# EAGLE design BOTS_Latch (EAGLE 9.2.2)
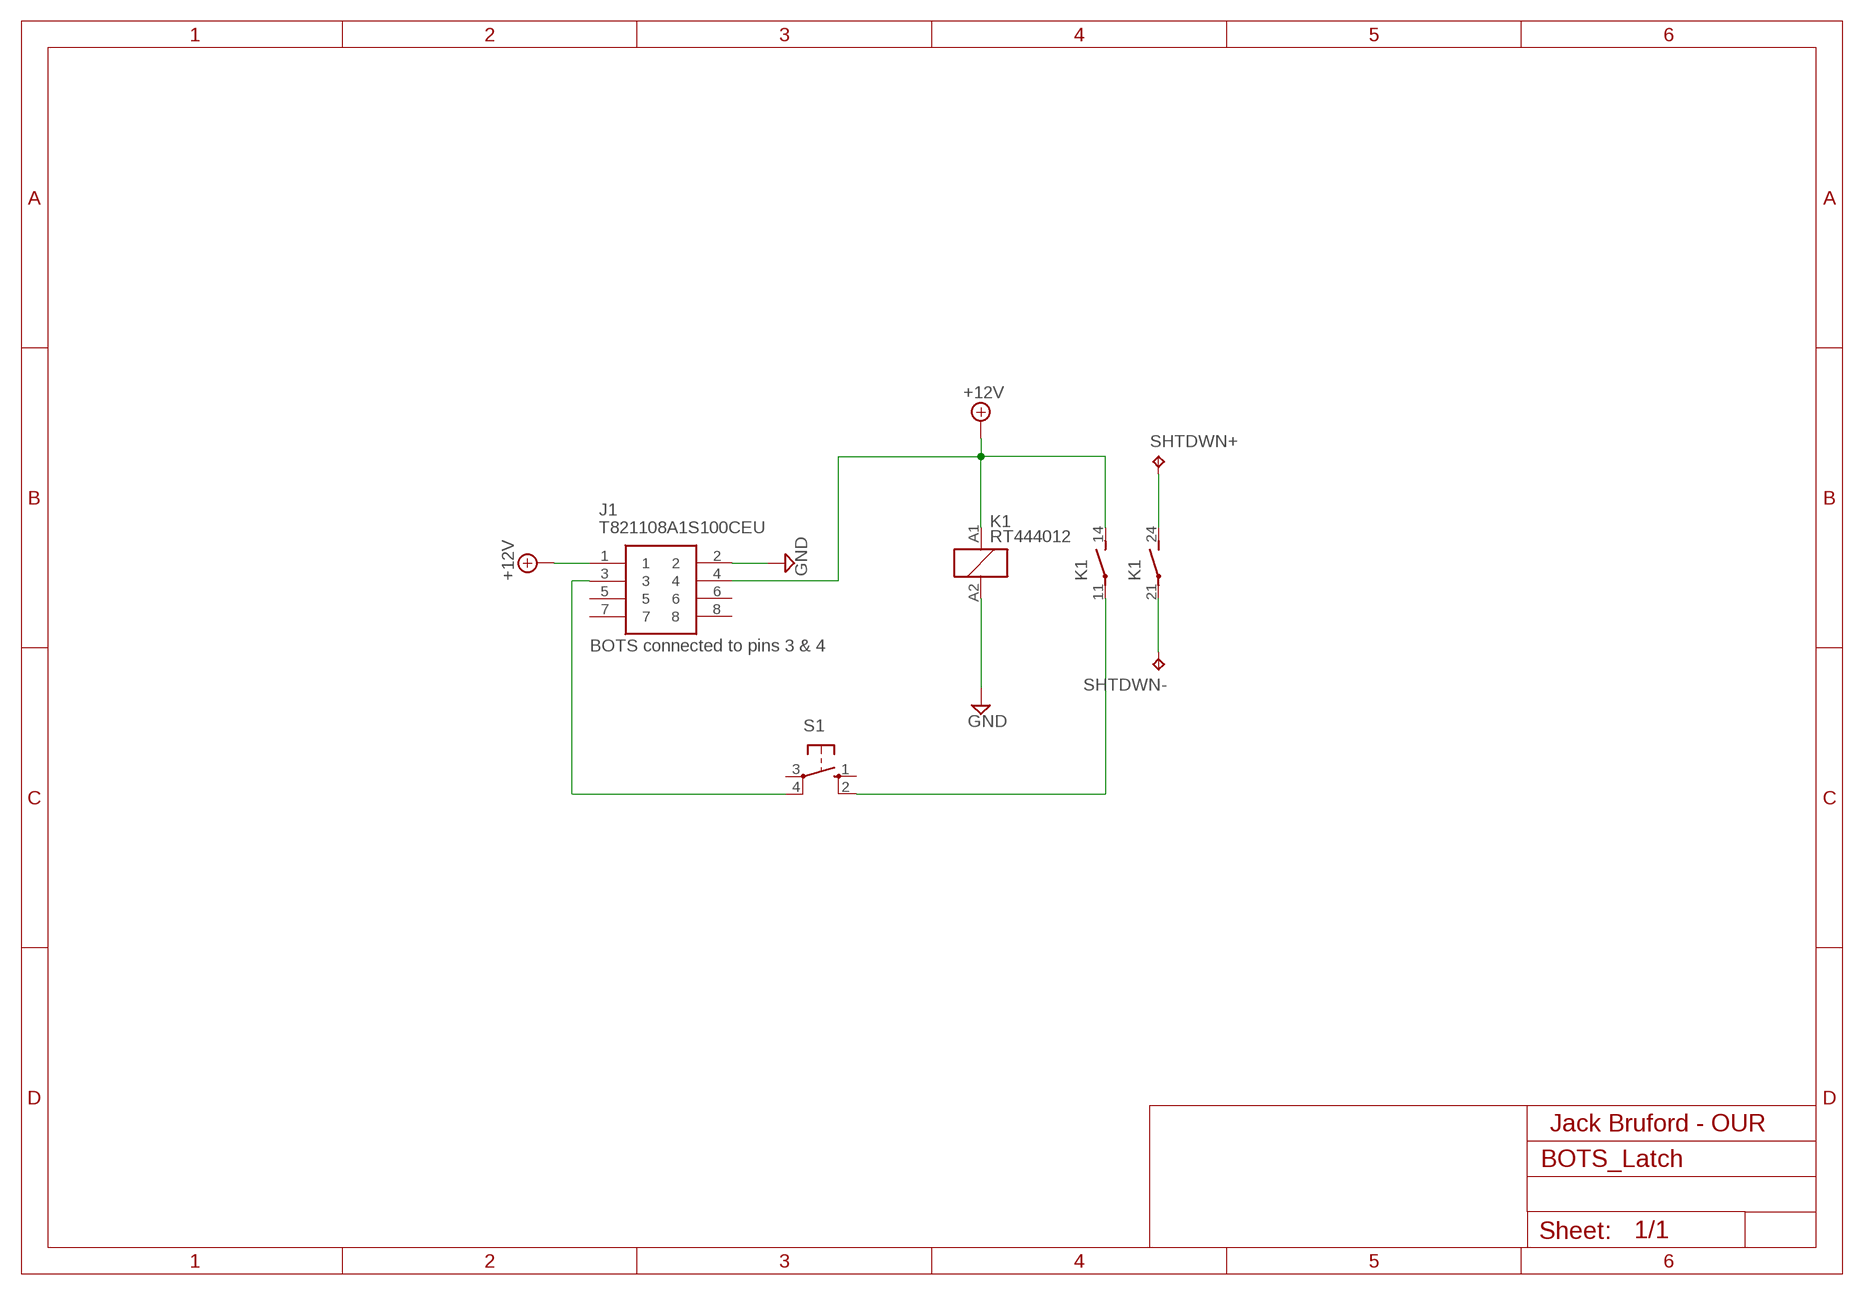
[diagram p0: schematic, sheet 1]

## Parts
J1  T821108A1S100CEU  [HDRV8W64P254_2X4_1778X895X915P]
K1  RT444012  [RT2N/O]
S1  10-XX  [B3F-10XX]
SHTDWN+  TPPAD1-13  [P1-13]
SHTDWN-  TPPAD1-13  [P1-13]

## Nets
+12V: J1.1 J1.4 K1.14(2:S) K1.A1
GND: J1.2 K1.A2
N$1: K1.11(2:P) S1.2(S1)
N$2: J1.3 S1.4(P1)
N$3: K1.24(3:S) SHTDWN+.TP
N$4: K1.21(3:P) SHTDWN-.TP
Unconnected: J1.5 J1.6 J1.7 J1.8 S1.1(S) S1.3(P)

## Notes on the sheet
- BOTS connected to pins 3 & 4
- Jack Bruford - OUR

## Library data of the parts
J1 = T821108A1S100CEU:T821108A1S100CEU: HEADER, VERTICAL, 2.54MM, 8WAY Amphenol T821 Series, 2.54mm Pitch 8 Way 2 Row Straight PCB Header, Solder Termination, 3A Source: Datasheet <http://uk.rs-online.com/web/p/products/1702738>; DESCRIPTION: HEADER, VERTICAL, 2.54MM, 8WAY Amphenol T821 Series, 2.54mm Pitch 8 Way 2 Row Straight PCB Header, Solder Termination, 3A; HEIGHT: 9.15mm; MANUFACTURER_NAME: Amphenol; MANUFACTURER_PART_NUMBER: T821108A1S100CEU; RS_PART_NUMBER: 1702738
K1 = relay:RT44?*: Power PCB Relay SCHRACK 2 pole 8 A, DC and AC-coil Source: http://www.schrack.com/.. 5842.pdf; OC_FARNELL: unknown; OC_NEWARK: unknown
S1 = switch-omron:10-XX: OMRON SWITCH; MPN: B3F-1000; OC_FARNELL: 176432; OC_NEWARK: 36M3542
SHTDWN+ SHTDWN- = testpad:TP: Test pad

## Board
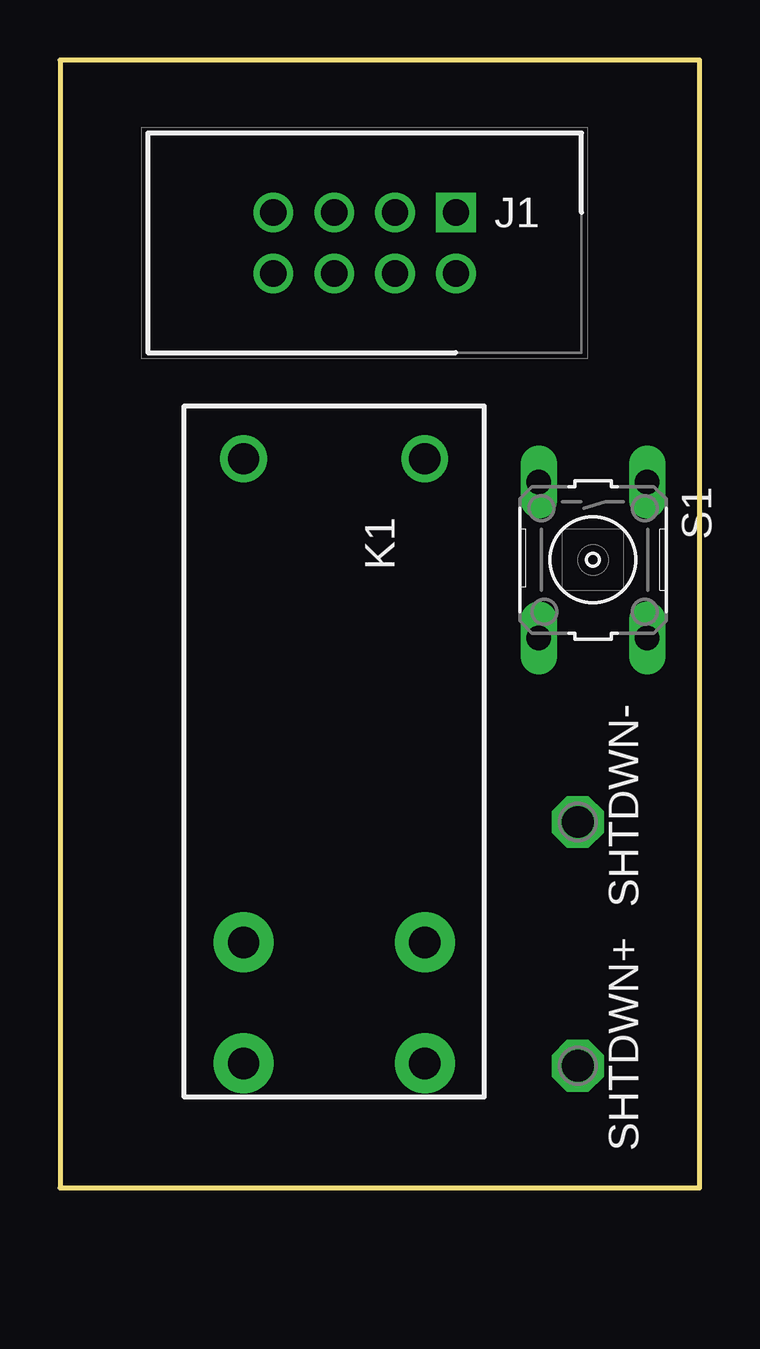
[diagram p1: board, top side]
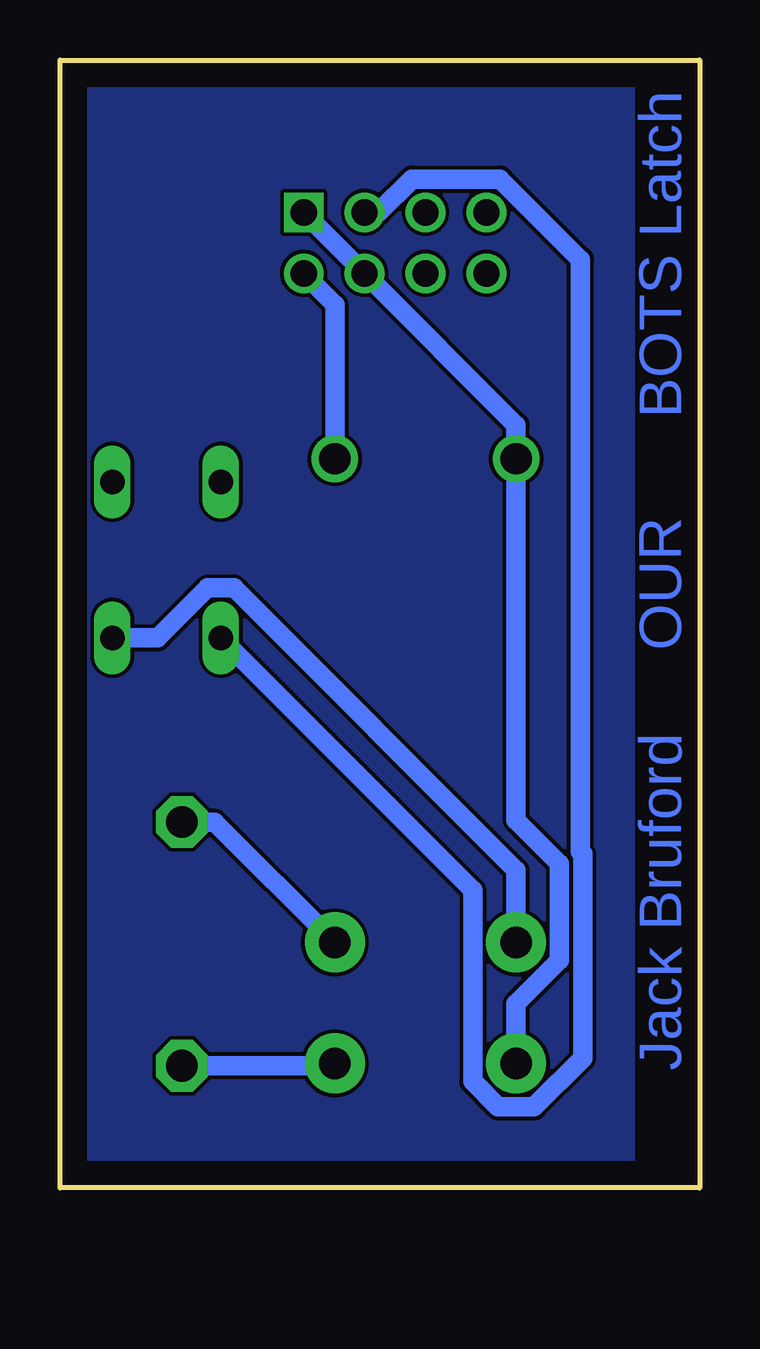
[diagram p2: board, bottom side, seen from below]

Size 26.67 x 46.99 mm. Coordinates in mm from the lower left corner, seen from the top.
Outline: 0,0 26.67,0 26.67,46.99 0,46.99 0,0
Copper layers (1*16): Top 0.035mm / dielectric 1.5mm / Bottom 0.035mm
Design rules "default": minimum track width 6mil, minimum drill 0.35mm, track to track 6mil, track to pad 6mil, pad to pad 6mil, via to via 6mil, smd to smd 6mil, copper to edge 40mil, drill to drill 6mil, minimum pad ring 10mil, minimum via ring 8mil, stop-mask expansion 4mil, vias tented up to drill 0mil, thermal gap 10mil

### Footprints (pad centres in the part's own frame; a part is rotated, then mirrored left to right if it is on the bottom)
HDRV8W64P254_2X4_1778X895X915P = drill 1.1 pad 1.65 square: 1 0,0 | drill 1.1 pad 1.65: 2 0,2.54; 3 2.54,0; 4 2.54,2.54; 5 5.08,0; 6 5.08,2.54; 7 7.62,0; 8 7.62,2.54
RT2N/O = drill 1.3 pad 2.5: 11 7.56,-3.78; 14 12.6,-3.78; 21 7.56,3.78; 24 12.6,3.78 | drill 1.3: A1 -12.6,-3.78; A2 -12.6,3.78
B3F-10XX = drill 1.016 long: 1 -3.251,2.261; 2 3.251,2.261; 3 -3.251,-2.261; 4 3.251,-2.261
P1-13 = drill 1.321 pad 2.159 octagon: TP 0,0

### Placement (x,y rotation side)
J1  16.51,40.64 180 top
K1  11.43,17.78 270 top
S1  22.23,26.16 270 top
SHTDWN+  21.59,5.08 0 top
SHTDWN-  21.59,15.24 0 top

### Tracks (layer width: path | path; a pad name or v marks a point on that pad's centre or on a via)
+12V
  Bottom 0.813: J1.1 J1.4 7.65,31.78 K1.A1 7.65,15.32 5.84,13.51 5.84,9.47 7.65,7.66 K1.14
GND
  Bottom 0.813: J1.2 15.21,36.8 K1.A2
N$1
  Bottom 0.813: S1.2 22.59,22.91 20.51,24.99 19.42,24.99 7.65,13.23 K1.11
N$2
  Bottom 0.813: J1.3 13.39,40.64 12,42.02 8.32,42.02 4.97,38.67 4.97,14 4.88,13.91 4.88,5.4 6.9,3.37 8.4,3.37 9.46,4.43 9.46,12.4 S1.4
N$3
  Bottom 0.813: K1.24 15.31,5.08 SHTDWN+.TP
N$4
  Bottom 0.813: SHTDWN-.TP 20.23,15.24 K1.21
N$5
  pour Bottom: 0,0 26.67,0 26.67,46.99 0,46.99

### Text on the board
Bottom: Jack Bruford OUR BOTS Latch